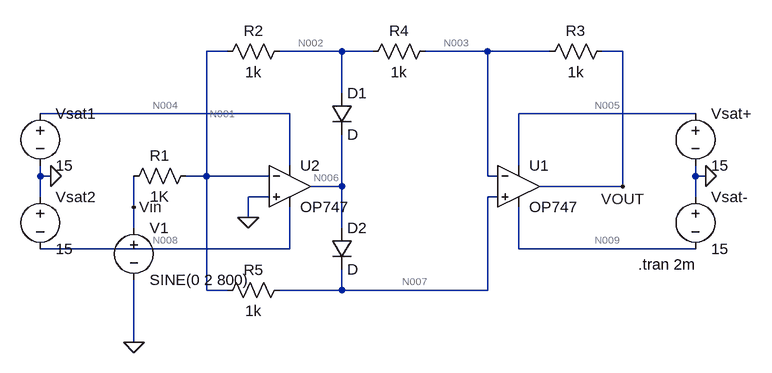
[diagram p0: schematic FULL_WAVE_RECTIFIER.asc]
FULL_WAVE_RECTIFIER.asc, the LTspice schematic file:
Version 4
SHEET 1 880 680
WIRE -64 -48 -96 -48
WIRE 112 -48 16 -48
WIRE 160 -48 112 -48
WIRE 336 -48 240 -48
WIRE 432 -48 336 -48
WIRE 544 -48 512 -48
WIRE 112 16 112 -48
WIRE 32 48 -352 48
WIRE 656 48 384 48
WIRE 32 128 32 48
WIRE 384 128 384 48
WIRE -352 144 -352 128
WIRE -336 144 -352 144
WIRE -96 144 -96 -48
WIRE -96 144 -128 144
WIRE 0 144 -96 144
WIRE 336 144 336 -48
WIRE 352 144 336 144
WIRE 656 144 656 128
WIRE 672 144 656 144
WIRE 112 160 112 80
WIRE 112 160 64 160
WIRE 544 160 544 -48
WIRE 544 160 416 160
WIRE -352 176 -352 144
WIRE 0 176 -32 176
WIRE 352 176 336 176
WIRE 656 176 656 144
WIRE -208 192 -208 144
WIRE -32 208 -32 176
WIRE -208 224 -208 192
WIRE 112 224 112 160
WIRE 32 256 32 192
WIRE 32 256 -352 256
WIRE 384 256 384 192
WIRE 656 256 384 256
WIRE -96 320 -96 144
WIRE -64 320 -96 320
WIRE 112 320 112 288
WIRE 112 320 16 320
WIRE 336 320 336 176
WIRE 336 320 112 320
WIRE -208 400 -208 304
FLAG 672 144 0
FLAG 544 160 VOUT
FLAG -208 192 Vin
FLAG -336 144 0
FLAG -32 208 0
FLAG -208 400 0
SYMBOL OpAmps\\OP747 384 96 R0
SYMATTR InstName U1
SYMBOL voltage 656 32 R0
WINDOW 123 0 0 Left 0
WINDOW 39 0 0 Left 0
SYMATTR InstName Vsat+
SYMATTR Value 15
SYMBOL voltage 656 160 R0
WINDOW 123 0 0 Left 0
WINDOW 39 0 0 Left 0
SYMATTR InstName Vsat-
SYMATTR Value 15
SYMBOL OpAmps\\OP747 32 96 R0
SYMATTR InstName U2
SYMBOL voltage -352 32 R0
WINDOW 123 0 0 Left 0
WINDOW 39 0 0 Left 0
SYMATTR InstName Vsat1
SYMATTR Value 15
SYMBOL voltage -352 160 R0
WINDOW 123 0 0 Left 0
WINDOW 39 0 0 Left 0
SYMATTR InstName Vsat2
SYMATTR Value 15
SYMBOL res -112 128 R90
WINDOW 0 0 56 VBottom 2
WINDOW 3 32 56 VTop 2
SYMATTR InstName R1
SYMATTR Value 1K
SYMBOL res 32 -64 R90
WINDOW 0 0 56 VBottom 2
WINDOW 3 32 56 VTop 2
SYMATTR InstName R2
SYMATTR Value 1k
SYMBOL res 528 -64 R90
WINDOW 0 0 56 VBottom 2
WINDOW 3 32 56 VTop 2
SYMATTR InstName R3
SYMATTR Value 1k
SYMBOL res 256 -64 R90
WINDOW 0 0 56 VBottom 2
WINDOW 3 32 56 VTop 2
SYMATTR InstName R4
SYMATTR Value 1k
SYMBOL res 32 304 R90
WINDOW 0 0 56 VBottom 2
WINDOW 3 32 56 VTop 2
SYMATTR InstName R5
SYMATTR Value 1k
SYMBOL diode 96 16 R0
SYMATTR InstName D1
SYMBOL diode 96 224 R0
SYMATTR InstName D2
SYMBOL voltage -208 208 R0
WINDOW 123 0 0 Left 0
WINDOW 39 0 0 Left 0
SYMATTR InstName V1
SYMATTR Value SINE(0 2 800)
TEXT 568 280 Left 2 !.tran 2m

The netlist it stands for:
* FULL_WAVE_RECTIFIER.asc
XU1 N007 N003 N005 N009 VOUT OP747  ; pins In+ In- V+ V- OUT
Vsat+ N005 0 15
Vsat- 0 N009 15
XU2 0 N001 N004 N008 N006 OP747  ; pins In+ In- V+ V- OUT
Vsat1 N004 0 15
Vsat2 0 N008 15
R1 N001 Vin 1K
R2 N002 N001 1k
R3 VOUT N003 1k
R4 N003 N002 1k
R5 N007 N001 1k
D1 N002 N006 D
D2 N006 N007 D
V1 Vin 0 SINE(0 2 800)
.model D D
.lib standard.dio
.tran 2m
.backanno
.end

* Results of the author's LTspice run, read from the files saved beside the schematic
* Operating Point, zero values left out:
*   V(n003) = 180.7 µV
*   V(n009) = -15 V
*   V(n005) = 15 V
*   V(n007) = 100.7 µV
*   V(vout) = 222.3 µV
*   V(n001) = 79.99 µV
*   V(n008) = -15 V
*   V(n004) = 15 V
*   V(n006) = 357.2 mV
*   V(n002) = 130.4 µV
*   I(D2) = 9.897 nA
*   I(R5) = 20.75 nA
*   I(R4) = 50.38 nA
*   I(R3) = 41.52 nA
*   I(R2) = 50.38 nA
*   I(R1) = 79.99 nA
*   I(V1) = 79.99 nA
*   I(Vsat2) = -304.3 µA
*   I(Vsat1) = -304.3 µA
*   I(Vsat-) = -304.4 µA
*   I(Vsat+) = -304.4 µA
*   Ix(u1:1) = -10.86 nA
*   Ix(u1:2) = -8.856 nA
*   Ix(u1:99) = 304.4 µA
*   Ix(u1:50) = -304.4 µA
*   Ix(u1:45) = -41.52 nA
*   Ix(u2:1) = -10.86 nA
*   Ix(u2:2) = -8.856 nA
*   Ix(u2:99) = 304.3 µA
*   Ix(u2:50) = -304.3 µA
*   Ix(u2:45) = -9.898 nA
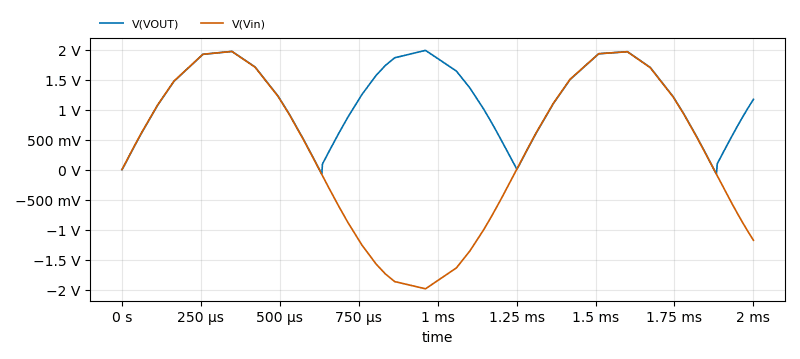
[diagram p1: Transient Analysis of FULL_WAVE_RECTIFIER.asc, plotted from the saved traces]
* Transient Analysis, 1 run:
*   V(VOUT): min -70.83 mV, max 1.986 V, average 1.217 V, rms 1.368 V, last 1.17 V
*   V(Vin): min -1.985 V, max 1.968 V, average 354.7 mV, rms 1.368 V, last -1.176 V